# Altium schematic sheet Public_CPU_SLIC_Power.SchDoc
size D
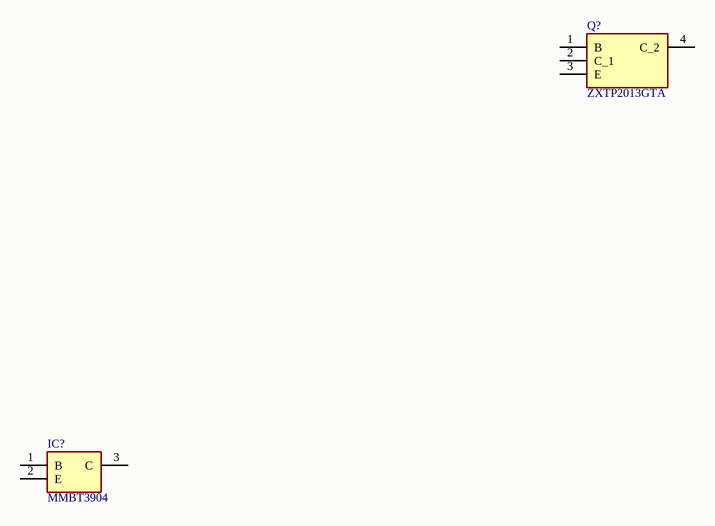
[diagram p0: Public_CPU_SLIC_Power.SchDoc]

## Parts
IC?  MMBT3904  [SOT95P240X120-3N]
Q?  ZXTP2013GTA  [SOT230P700X165-4N]

## Nets

Not connected (* = marked no-connect by the designer): IC? 1(B) 2(E) 3(C); Q? 1(B) 2(C_1) 3(E) 4(C_2)

## Notes on the sheet
- Title
- Size:
- Date:
- File:
- D
- Number:
- Time:
- Revision:
- Sheet
- of

## Library data of the parts
IC? = MMBT3904: Integrated Circuit; Manufacturer_Name: Diotec; Datasheet Link: https://media.digikey.com/pdf/Data%20Sheets/ON%20Semiconductor%20PDFs/2N3904,MMBT3904,PZT3904.pdf; Height: 1.2mm; Manufacturer_Part_Number: MMBT3904; Arrow Part Number: MMBT3904; Arrow Price/Stock: https://www.arrow.com/en/products/mmbt3904/diotec-semiconductor-ag
Q? = ZXTP2013GTA: Transistor; Manufacturer_Name: Diodes Inc.; Datasheet Link: https://www.diodes.com/assets/Datasheets/ZXTP2013G.pdf; Height: 1.65mm; Manufacturer_Part_Number: ZXTP2013GTA; Mouser Part Number: 522-ZXTP2013GTA; Mouser Price/Stock: https://www.mouser.co.uk/ProductDetail/Diodes-Incorporated/ZXTP2013GTA?qs=mD3CqBXk%252BSvmV2kcl4IC%2Fw%3D%3D; Arrow Part Number: ZXTP2013GTA; Arrow Price/Stock: https://www.arrow.com/en/products/zxtp2013gta/diodes-incorporated